# Altium schematic sheet Thermostat_Master.SchDoc
size A
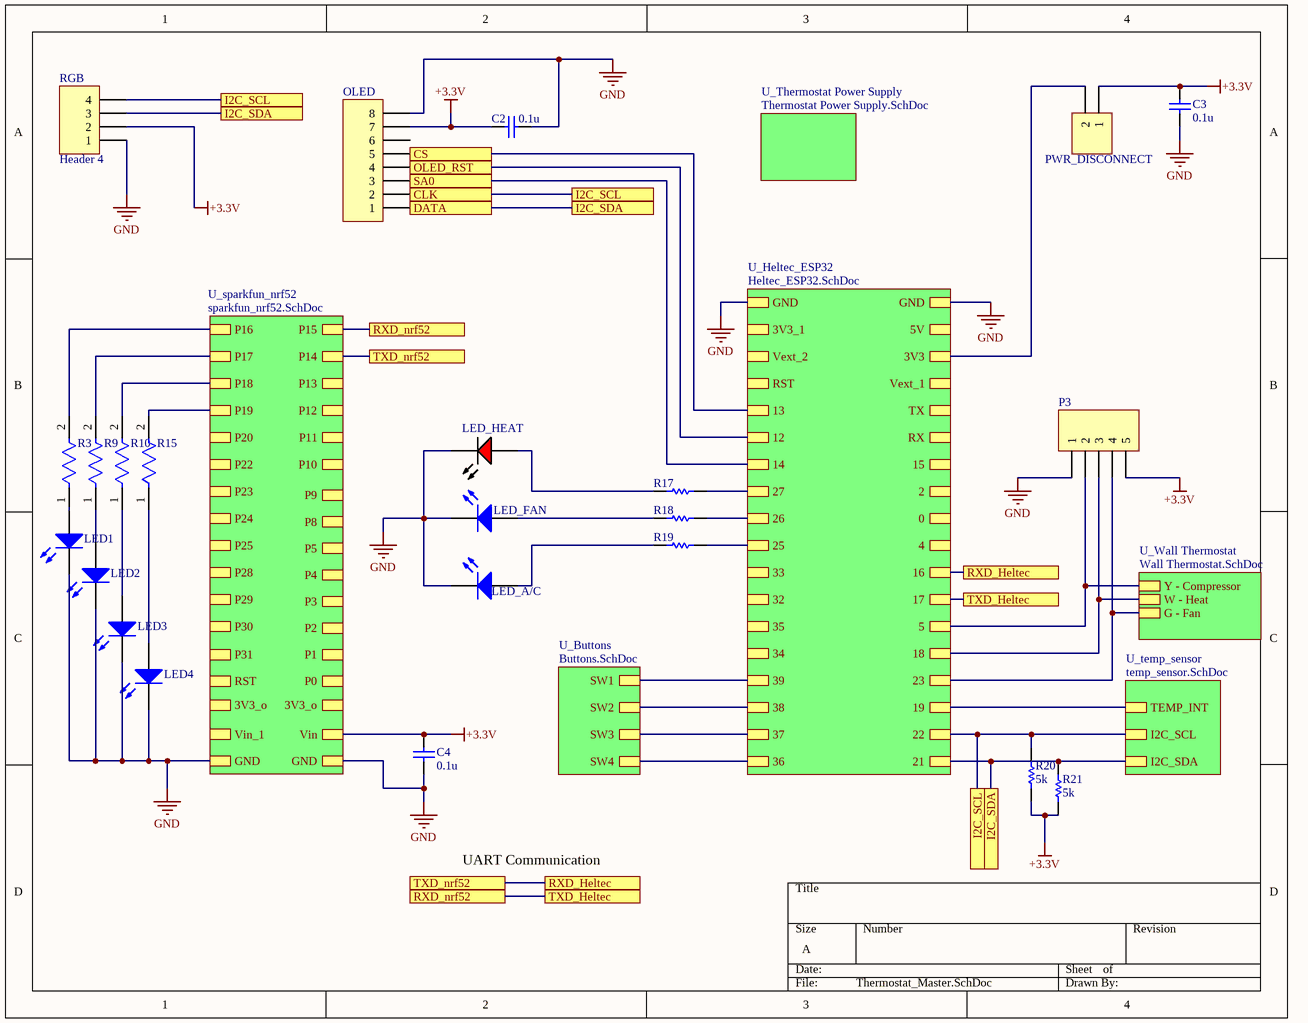
[diagram p0: Thermostat_Master.SchDoc]

## Parts
C2  0.1u  [CAPC2013X145X50LL20T25]
C3  0.1u  [CAPC2013X145X50LL20T25]
C4  0.1u  [CAPC2013X145X50LL20T25]
LED1  (no value)  [1206_A]
LED2  (no value)  [1206_A]
LED3  (no value)  [1206_A]
LED4  (no value)  [1206_A]
LED_A/C  (no value)  [1206_A]
LED_FAN  (no value)  [1206_A]
LED_HEAT  LTST-C150KRKT  [LTST-C150KRKT_V]  (value not drawn)
OLED  Header 8  [HDR1X8]  (value not drawn)
P3  Header 5  [HDR1X5]  (value not drawn)
PWR_DISCONNECT  Header 2  [HDR1X2]  (value not drawn)
R3  (no value)  [FP-RC1206-MFG]
R9  (no value)  [FP-RC1206-MFG]
R10  (no value)  [FP-RC1206-MFG]
R15  (no value)  [FP-RC1206-MFG]
R17  RC0805FR-07100RL  [RESC2013X60X35ML10T20]  (value not drawn)
R18  RC0805FR-07100RL  [RESC2013X60X35ML10T20]  (value not drawn)
R19  RC0805FR-07100RL  [RESC2013X60X35ML10T20]  (value not drawn)
R20  5k  [RESC2013X70X40LL20T20]
R21  5k  [RESC2013X70X40LL20T20]
RGB  Header 4  [HDR1X4]

## Sub-sheets
U_Buttons = Buttons.SchDoc: SW1, SW3, SW4, SW2
U_Heltec_ESP32 = Heltec_ESP32.SchDoc: GND, 5V, 3V3, Vext_1, TX, RX, 15, 2, 0, 4, 16, 17, 5, 18, 23, 19, 22, 21, GND, 3V3_1, Vext_2, RST, 13, 12, 14, 27, 26, 25, 33, 32, 35, 34, 39, 38, 37, 36
U_sparkfun_nrf52 = sparkfun_nrf52.SchDoc: P16, P17, P18, P19, P20, P22, P23, P24, P25, P28, P29, P30, P31, RST, Vin_1, GND, P15, P14, P13, P12, P11, P10, P9, P8, P5, P4, P3, P2, P1, P0, GND, 3V3_o, 3V3_o, Vin
U_temp_sensor = temp_sensor.SchDoc: I2C_SCL, TEMP_INT, I2C_SDA
U_Thermostat Power Supply = Thermostat Power Supply.SchDoc: no entries
U_Wall Thermostat = Wall Thermostat.SchDoc: Y - Compressor, W - Heat, G - Fan

## Ports
CLK, CS, DATA, I2C_SCL, I2C_SDA, OLED_RST, RXD_Heltec, RXD_nrf52, SA0, TXD_Heltec, TXD_nrf52

## Nets
+3.3V: C2.2 C3.2 C4.2 OLED.7 P3.5 PWR_DISCONNECT.1 R20.1 R21.1 RGB.2 ; sheet U_sparkfun_nrf52/Vin
GND: C2.1 C3.1 C4.1 LED1.1(K) LED2.1(K) LED3.1(K) LED4.1(K) LED_A/C.1(K) LED_FAN.1(K) LED_HEAT.2(K) OLED.8 P3.1 RGB.1 ; sheet U_sparkfun_nrf52/GND, sheet U_sparkfun_nrf52/GND, sheet U_Heltec_ESP32/GND, sheet U_Heltec_ESP32/GND
CLK: OLED.2 R20.2 RGB.4 ; port CLK, port I2C_SCL, sheet U_Heltec_ESP32/22, sheet U_temp_sensor/I2C_SCL
CS: OLED.5 ; port CS, sheet U_Heltec_ESP32/13
DATA: OLED.1 R21.2 RGB.3 ; port DATA, port I2C_SDA, sheet U_Heltec_ESP32/21, sheet U_temp_sensor/I2C_SDA
OLED_RST: OLED.4 ; port OLED_RST, sheet U_Heltec_ESP32/12
RXD_Heltec: port RXD_Heltec, port TXD_nrf52, sheet U_sparkfun_nrf52/P14, sheet U_Heltec_ESP32/16
RXD_nrf52: port TXD_Heltec, port RXD_nrf52, sheet U_sparkfun_nrf52/P15, sheet U_Heltec_ESP32/17
SA0: OLED.3 ; port SA0, sheet U_Heltec_ESP32/14
NetLED1_2: LED1.2(A) R3.1
NetLED2_2: LED2.2(A) R9.1
NetLED3_2: LED3.2(A) R10.1
NetLED4_2: LED4.2(A) R15.1
NetLED_A/C_2: LED_A/C.2(A) R19.1
NetLED_FAN_2: LED_FAN.2(A) R18.1
NetLED_HEAT_1: LED_HEAT.1(A) R17.1
NetP3_2: P3.2 ; sheet U_Heltec_ESP32/5, sheet U_Wall Thermostat/Y - Compressor
NetP3_3: P3.3 ; sheet U_Heltec_ESP32/18, sheet U_Wall Thermostat/W - Heat
NetP3_4: P3.4 ; sheet U_Heltec_ESP32/23, sheet U_Wall Thermostat/G - Fan
NetPWR_DISCONNECT_2: PWR_DISCONNECT.2 ; sheet U_Heltec_ESP32/3V3
NetR3_2: R3.2 ; sheet U_sparkfun_nrf52/P16
NetR9_2: R9.2 ; sheet U_sparkfun_nrf52/P17
NetR10_2: R10.2 ; sheet U_sparkfun_nrf52/P18
NetR15_2: R15.2 ; sheet U_sparkfun_nrf52/P19
NetR17_2: R17.2 ; sheet U_Heltec_ESP32/27
NetR18_2: R18.2 ; sheet U_Heltec_ESP32/26
NetR19_2: R19.2 ; sheet U_Heltec_ESP32/25
(unnamed): sheet U_Heltec_ESP32/19, sheet U_temp_sensor/TEMP_INT
(unnamed): sheet U_Heltec_ESP32/39, sheet U_Buttons/SW1
(unnamed): sheet U_Heltec_ESP32/38, sheet U_Buttons/SW2
(unnamed): sheet U_Heltec_ESP32/37, sheet U_Buttons/SW3
(unnamed): sheet U_Heltec_ESP32/36, sheet U_Buttons/SW4

Not connected (* = marked no-connect by the designer): OLED 6

## Notes on the sheet
- UART Communication

## Library data of the parts
C2-C4 = CMP-2007-01258-1: C0805C104Z5VACTU; Manufacturer: Kemet; Part Number: C0805C104Z5VACTU
LED1-LED4 = CMP-1426-00016-1: QTLP650C4TR / 1206 green led; PartNumber: 150120VS75000; Manufacturer: Wuerth Elektronik; Color: Bright Green; ComponentLink2URL: http://katalog.we-online.com/led/datasheet/150120VS75000.pdf; ComponentLink2Description: Datasheet; ComponentLink1URL: http://www.we-online.com; PackageReference: 1206_A; ComponentLink1Description: Manufacturer URL
LED_A/C = CMP-1426-00016-1: QTLP650C4TR / 1206 green led; PartNumber: LTST-C150TBKT; ComponentLink2URL: http://katalog.we-online.com/led/datasheet/150120VS75000.pdf; Color: Blue; ComponentLink2Description: Datasheet; ComponentLink1URL: http://www.we-online.com; PackageReference: 1206_A; ComponentLink1Description: Manufacturer URL
LED_FAN = CMP-1426-00016-1: LTST-C150GKT / 1206 green led; ComponentLink2URL: http://katalog.we-online.com/led/datasheet/150120VS75000.pdf; PartNumber: LTST-C150GKT; Color: Bright Green; ComponentLink2Description: Datasheet; ComponentLink1URL: http://www.we-online.com; PackageReference: 1206_A; ComponentLink1Description: Manufacturer URL
LED_HEAT = CMP-2000-06617-1: LED Red, 62.5 mW, 50 mA, -30 to 85 degC, 2-Pin SMD, RoHS, Tape and Reel; Manufacturer: Lite-On; Chip Material: AlGaInP; Product Depth (mm): 1.6mm; Luminous Intensity: 54mcd; Number of  Elements: 1; Reverse Voltage: 5V; Viewing Angle: 130deg; Rad Hardened: No; Shape Type: Rectangular; Peak Wavelength: 639nm; Forward Current: 30mA; Main Category: ChipLED; Product Height (mm): 1.1mm; Forward Voltage: 2.4V; Product Length (mm): 3.2mm; High Brightness: Yes; DELETED: Compliant; Test Current (It): 20mA; Power Dissipation: 75W; Dominant Wave Length: 631nm; Mounting: SurfaceMount; Package Type: ChipLed; Manufacturer URL: http://www.us.liteon.com/; Datasheet Version: Rev. C, 01/2013; Lens Dimensions: 2.06X1.6X0.6mm; Package Reference: C150KRKT; Operating Temp Range: -55Cto85C; Packaging: TapeandReel; Package Description: 2-Pin Surface Mount Device, Body 3.2 x 1.6 mm; Lum Intensity: 54mcd; Datasheet URL: http://optoelectronics.liteon.com/upload/download/DS-22-99-0149/S_110_LTST-C150KRKT.pdf; Emitting Color: Red; Operating Temperature Classification: Industrial; Mounting Technology: SurfaceMount; Type: Uni-Color; Pin Count: 2
OLED = Header 8: Header, 8-Pin; LatestRevisionDate: 17-Jul-2002; LatestRevisionNote: Re-released for DXP Platform.; Publisher: Altium Limited
P3 = Header 5: Header, 5-Pin; LatestRevisionDate: 17-Jul-2002; LatestRevisionNote: Re-released for DXP Platform.; Publisher: Altium Limited
PWR_DISCONNECT = Header 2: Header, 2-Pin; LatestRevisionDate: 17-Jul-2002; LatestRevisionNote: Re-released for DXP Platform.; Publisher: Altium Limited
R3 R9 R10 R15 = CMP-03412-007570-1: 360 ohms resistor / 1206 package; Manufacturer Part Number: RC1206JR-070RL; Manufacturer: YAGEO; Voltage Rating: 200V; Temperature Coefficient: 300ppm/°C; Power Rating: 0.25W; Value: 0Ω; Tolerance: 5%; Temperature Range Low: -55°C; Category: Res; Automotive: No; Ipc Land Pattern Name: RESC310160X55; Device Class L1: Passive Components; Temperature: -55°C to +155°C; ComponentLink2URL: https://www.yageo.com/upload/media/product/productsearch/datasheet/rchip/PYu-RC_Group_51_RoHS_L_10.pdf; Lead Free: Yes; Height: 0.65mm; Footprint Url: https://www.yageo.com/upload/website/yageo_PYu-R_Mount_10_19050818_343.pdf; Package: RC1206; Digikey Description: RES SMD 0 OHM JUMPER 1/4W 1206; Temperature Range High: +155°C; Device Class L3: Chip SMD Resistors; Device Class L2: Resistors; Octopart: https://octopart.com/rc1206jr-070rl-yageo-40025601; Resistance: 0Ω; Series: RC; ComponentLink2Description: Datasheet; Composition: Thick Film; RoHS: TRUE; Mouser Description: Resistor: thick film; SMD; 1206; 0O; 0.25W; ±5%; -55÷155°C
R17-R19 = CMP-2100-03669-1: Chip Resistor, 100 Ohm, +/-1%, 0.125 W, -55 to 155 degC, 0805 (2012 Metric), RoHS, Tape and Reel; Manufacturer: Yageo; Power Rating: 125mW; Resistance: 100Ohm; Voltage Rating: 150V; Tolerance: 1%; Temperature Coefficient: 100ppm/degreesC; Length: 2mm; Package Description: 2-Pin Surface Mounted Device, Body 2 x 1.25 mm; Case Code (Imperial): 0805; Number of Pins: 2; Termination: SMD/SMT; Lead Pitch: 0.4mm; Package Quantity: 1; Height: 0.024inch; Case Code (Metric): 2012; Number of Terminations: 2; Datasheet Version: Rev. 5, 10/2016; Lead Free: LeadFree; Package Reference: 0805; Composition: ThickFilm; REACH SVHC: Unknown; Voltage Rating (DC): 150V; Min Operating Temperature: -55degC; Packaging: TapeandReel; Military Standard: Not; Case/Package: 0805; Datasheet URL: http://www.yageo.com/NewPortal/yageodocoutput?fileName=/pdf/R-Chip/PYu-RC_Group_51_RoHS_L_5.pdf; Max Operating Temperature: 155degC; Manufacturer URL: http://www.yageo.com/; Max Power Dissipation: 125mW; Width: 0.049inch; Depth: 1.25mm; RoHSCompliant: true
R20 R21 = CMP-2001-00419-1: 2012; Part Number: ERJ-6GEYJ471V; Manufacturer: Panasonic
RGB = Header 4: Header, 4-Pin; LatestRevisionDate: 17-Jul-2002; LatestRevisionNote: Re-released for DXP Platform.; Publisher: Altium Limited